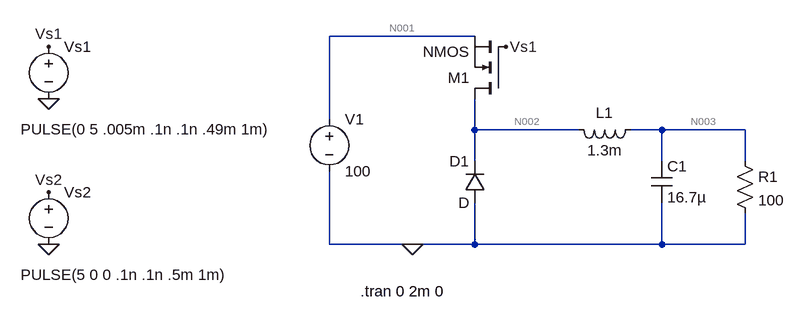
[diagram p0: schematic Draft4.asc]
Draft4.asc, the LTspice schematic file:
Version 4
SHEET 1 988 680
WIRE 496 16 272 16
WIRE 272 144 272 16
WIRE 496 160 496 112
WIRE 656 160 496 160
WIRE 784 160 736 160
WIRE 912 160 784 160
WIRE 496 208 496 160
WIRE 784 208 784 160
WIRE 912 208 912 160
WIRE 272 336 272 224
WIRE 400 336 272 336
WIRE 496 336 496 272
WIRE 496 336 400 336
WIRE 784 336 784 272
WIRE 784 336 496 336
WIRE 912 336 912 288
WIRE 912 336 784 336
FLAG 400 336 0
FLAG -160 112 0
FLAG -160 32 Vs1
FLAG 544 32 Vs1
FLAG -160 336 0
FLAG -160 256 Vs2
SYMBOL voltage 272 128 R0
WINDOW 123 0 0 Left 0
WINDOW 39 0 0 Left 0
SYMATTR InstName V1
SYMATTR Value 100
SYMBOL nmos 544 112 R180
SYMATTR InstName M1
SYMBOL voltage -160 16 R0
WINDOW 3 -43 143 Left 2
WINDOW 123 0 0 Left 0
WINDOW 39 0 0 Left 0
SYMATTR Value PULSE(0 5 .005m .1n .1n .49m 1m)
SYMATTR InstName Vs1
SYMBOL voltage -160 240 R0
WINDOW 3 -43 143 Left 2
WINDOW 123 0 0 Left 0
WINDOW 39 0 0 Left 0
SYMATTR Value PULSE(5 0 0 .1n .1n .5m 1m)
SYMATTR InstName Vs2
SYMBOL ind 752 144 R90
WINDOW 0 5 56 VBottom 2
WINDOW 3 32 56 VTop 2
SYMATTR InstName L1
SYMATTR Value 1.3m
SYMBOL cap 768 208 R0
SYMATTR InstName C1
SYMATTR Value 16.7µ
SYMBOL res 896 192 R0
SYMATTR InstName R1
SYMATTR Value 100
SYMBOL diode 512 272 R180
WINDOW 0 24 64 Left 2
WINDOW 3 24 0 Left 2
SYMATTR InstName D1
TEXT 320 408 Left 2 !.tran 0 2m 0

The netlist it stands for:
* Draft4.asc
V1 N001 0 100
M1 N002 Vs1 N001 N001 NMOS
Vs1 Vs1 0 PULSE(0 5 .005m .1n .1n .49m 1m)
Vs2 Vs2 0 PULSE(5 0 0 .1n .1n .5m 1m)
L1 N003 N002 1.3m
C1 N003 0 16.7µ
R1 N003 0 100
D1 0 N002 D
.model D D
.lib standard.dio
.model NMOS NMOS
.model PMOS PMOS
.lib standard.mos
.tran 0 2m 0
.backanno
.end

* Results of the author's LTspice run, read from the files saved beside the schematic
* Operating Point, zero values left out:
*   V(n001) = 100 V
*   V(n002) = 99.12 V
*   V(vs2) = 5 V
*   V(n003) = 99.11 V
*   Id(M1) = -7.004 A
*   Ib(M1) = 7.004 A
*   I(D1) = -99.13 pA
*   I(L1) = -991.1 mA
*   I(R1) = 991.1 mA
*   I(V1) = -991.1 mA
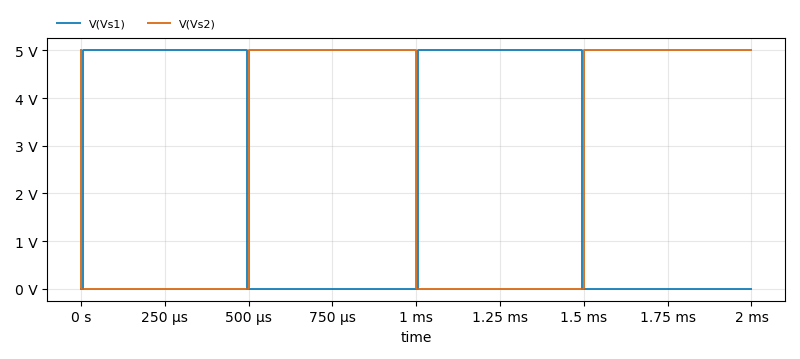
[diagram p1: Transient Analysis of Draft4.asc, plotted from the saved traces]
* Transient Analysis, 1 run:
*   V(Vs1): min 0 V, max 5 V, average 2.45 V, rms 3.5 V, last 0 V
*   V(Vs2): min 0 V, max 5 V, average 2.5 V, rms 3.536 V, last 5 V